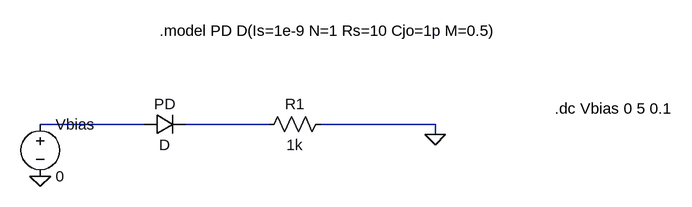
[diagram p0: schematic pd.asc]
pd.asc, the LTspice schematic file:
Version 4
SHEET 1 948 680
WIRE 128 240 -32 240
WIRE 320 240 192 240
WIRE 576 240 400 240
WIRE 576 256 576 240
FLAG 576 256 0
FLAG -32 320 0
SYMBOL voltage -32 224 R0
SYMATTR InstName Vbias
SYMATTR Value 0
SYMBOL diode 128 256 R270
WINDOW 0 32 32 VTop 2
WINDOW 3 0 32 VBottom 2
SYMATTR InstName PD
SYMBOL Res 416 224 R90
WINDOW 0 0 56 VBottom 2
WINDOW 3 32 56 VTop 2
SYMATTR InstName R1
SYMATTR Value 1k
TEXT 152 96 Left 2 !.model PD D(Is=1e-9 N=1 Rs=10 Cjo=1p M=0.5)
TEXT 760 216 Left 2 !.dc Vbias 0 5 0.1

The netlist it stands for:
* pd.asc
Vbias N001 0 0
D§PD N001 N002 D
R1 0 N002 1k
.model D D
.lib standard.dio
.model PD D(Is=1e-9 N=1 Rs=10 Cjo=1p M=0.5)
.dc Vbias 0 5 0.1
.backanno
.end